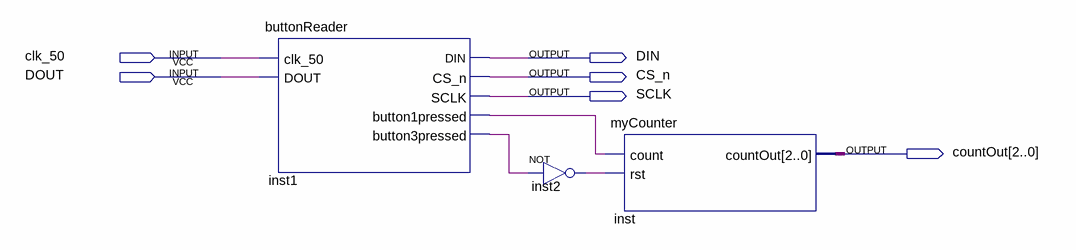
[diagram p0: schematic sheet]
// Quartus schematic CounterWithOutput.bdf as structural Verilog: 3 symbols, 6 pins
module CounterWithOutput (
  input  clk_50,
  input  DOUT,
  output DIN,
  output CS_n,
  output SCLK,
  output [2:0] countOut
);

  wire inst1_button1pressed, inst1_button3pressed, inst2_out;

  buttonReader inst1 (
    .clk_50(clk_50), .DOUT(DOUT), .DIN(DIN), .CS_n(CS_n), .SCLK(SCLK), .button1pressed(inst1_button1pressed),
    .button3pressed(inst1_button3pressed));
  not inst2 (inst2_out, inst1_button3pressed);
  myCounter inst (.count(inst1_button1pressed), .rst(inst2_out), .countOut(countOut));
endmodule
